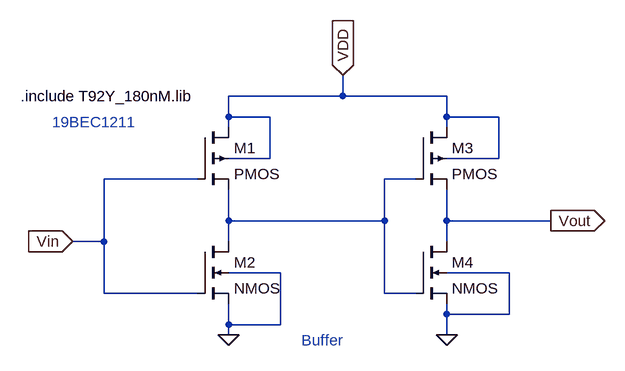
[diagram p0: schematic Buffer_Sym.asc]
Buffer_Sym.asc, the LTspice schematic file:
Version 4
SHEET 1 880 680
WIRE 304 -80 304 -112
WIRE 304 -80 128 -80
WIRE 464 -80 304 -80
WIRE 128 -48 128 -80
WIRE 192 -48 128 -48
WIRE 464 -48 464 -80
WIRE 544 -48 464 -48
WIRE 128 -32 128 -48
WIRE 464 -32 464 -48
WIRE 192 16 192 -48
WIRE 192 16 128 16
WIRE 544 16 544 -48
WIRE 544 16 464 16
WIRE 80 48 -64 48
WIRE 416 48 368 48
WIRE 128 112 128 64
WIRE 368 112 368 48
WIRE 368 112 128 112
WIRE 464 112 464 64
WIRE 624 112 464 112
WIRE -64 144 -64 48
WIRE -64 144 -112 144
WIRE 128 144 128 112
WIRE 464 144 464 112
WIRE 208 192 128 192
WIRE 560 192 464 192
WIRE -64 224 -64 144
WIRE 80 224 -64 224
WIRE 368 224 368 112
WIRE 416 224 368 224
WIRE 464 256 464 240
WIRE 560 256 560 192
WIRE 560 256 464 256
WIRE 128 272 128 240
WIRE 208 272 208 192
WIRE 208 272 128 272
WIRE 128 288 128 272
WIRE 464 288 464 256
FLAG 624 112 Vout
IOPIN 624 112 Out
FLAG -112 144 Vin
IOPIN -112 144 In
FLAG 128 288 0
FLAG 464 288 0
FLAG 304 -112 VDD
IOPIN 304 -112 In
SYMBOL pmos4 80 -32 R0
SYMATTR InstName M1
SYMBOL pmos4 416 -32 R0
SYMATTR InstName M3
SYMBOL nmos4 80 144 R0
SYMATTR InstName M2
SYMBOL nmos4 416 144 R0
SYMATTR InstName M4
TEXT -192 -80 Left 2 !.include T92Y_180nM.lib
TEXT -144 -40 Left 2 ;19BEC1211
TEXT 240 296 Left 2 ;Buffer

The netlist it stands for:
* Buffer_Sym.asc
M1 VDD Vin N001 VDD PMOS
M3 VDD N001 Vout VDD PMOS
M2 N001 Vin 0 0 NMOS
M4 Vout N001 0 0 NMOS
.model NMOS NMOS
.model PMOS PMOS
.lib standard.mos
.include T92Y_180nM.lib
* 19BEC1211
* Buffer
.backanno
.end